# EAGLE schematic MSSRP-DAC (EAGLE 6.6.0)
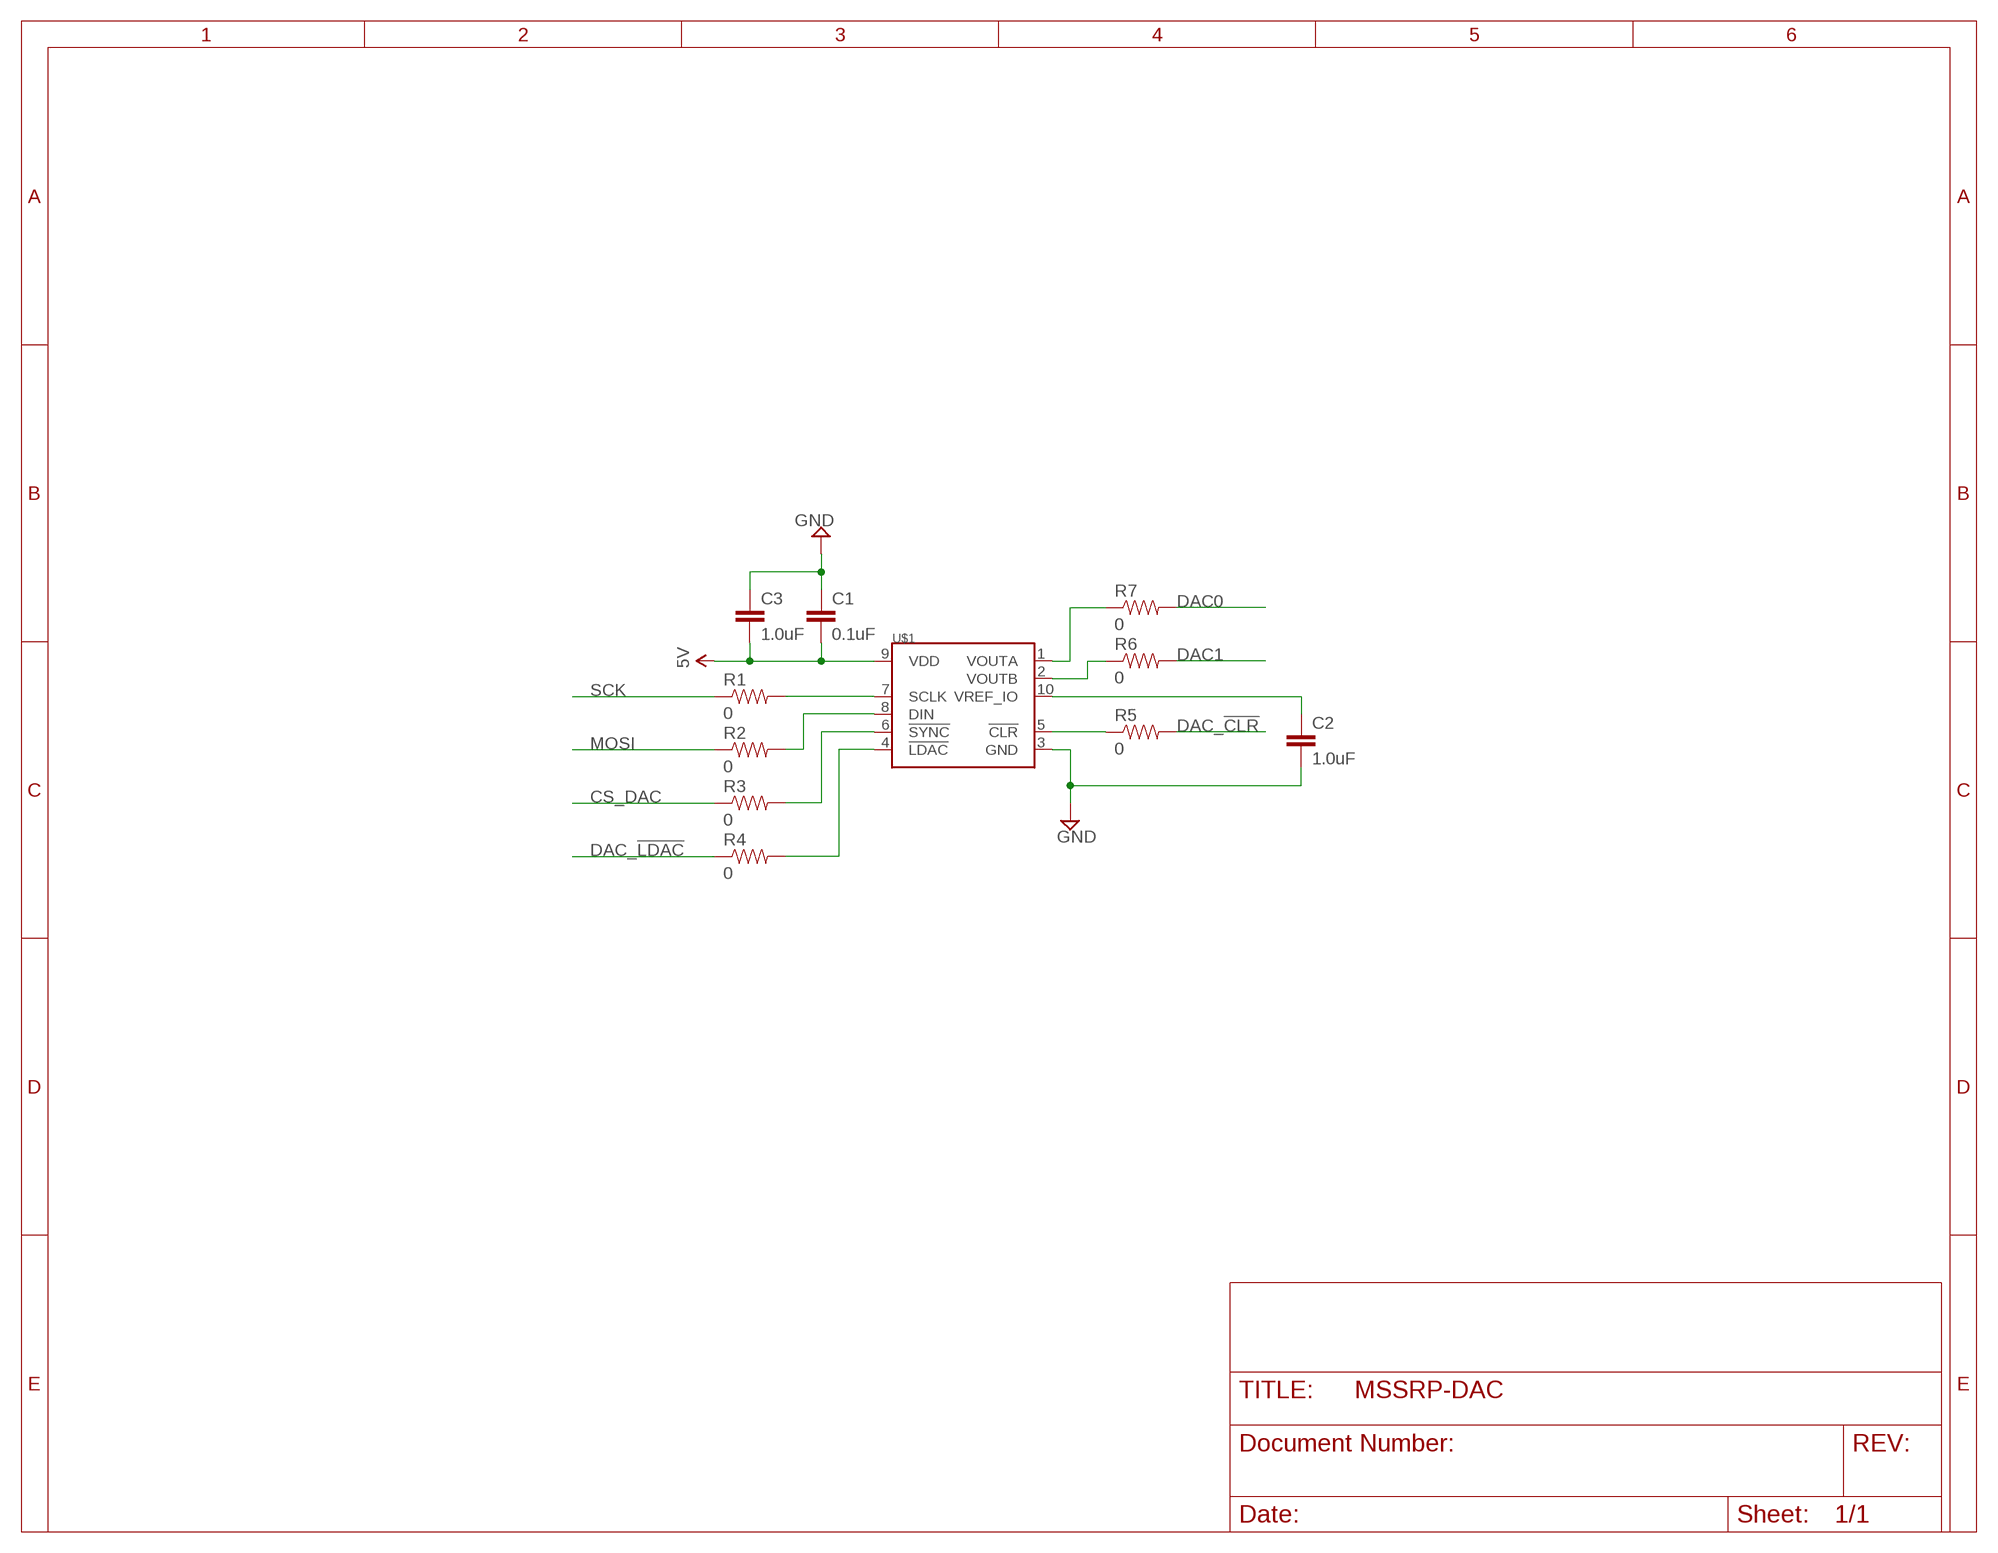
[diagram p0: schematic, sheet 1]

## Parts
C1  0.1uF  0.1UF-25V-5%(0603)  [0603-CAP]
C2  1.0uF  1.0UF-16V-10%(0603)  [0603-CAP]
C3  1.0uF  1.0UF-16V-10%(0603)  [0603-CAP]
R1  0  0OHM1/10W5%(0603)  [0603]
R2  0  0OHM1/10W5%(0603)  [0603]
R3  0  0OHM1/10W5%(0603)  [0603]
R4  0  0OHM1/10W5%(0603)  [0603]
R5  0  0OHM1/10W5%(0603)  [0603]
R6  0  0OHM1/10W5%(0603)  [0603]
R7  0  0OHM1/10W5%(0603)  [0603]
U$1  DAC7562  [MSOP10]

## Nets
5V: C1.2 C3.2 U$1.9(VDD)
CS_DAC: R3.1
DAC0: R7.2
DAC1: R6.2
DAC_!CLR: R5.2
DAC_!LDAC: R4.1
GND: C1.1 C2.2 C3.1 U$1.3(GND)
MOSI: R2.1
N$1: R1.2 U$1.7(SCLK)
N$2: R2.2 U$1.8(DIN)
N$3: R3.2 U$1.6(!SYNC)
N$4: R4.2 U$1.4(!LDAC)
N$5: C2.1 U$1.10(VREF_IO)
N$6: R6.1 U$1.2(VOUTB)
N$7: R7.1 U$1.1(VOUTA)
N$9: R5.1 U$1.5(!CLR)
SCK: R1.1

## Library data of the parts
C1 = SparkFun-Capacitors:0.1UF-25V-5%(0603): CAP-08604; PROD_ID: CAP-08604
C2 C3 = SparkFun-Capacitors:1.0UF-16V-10%(0603): CAP-00868; PROD_ID: CAP-00868
R1-R7 = SparkFun-Resistors:0OHM1/10W5%(0603): RES-08609; PROD_ID: RES-08609
U$1 = MSSRP-Lib:DAC7562